# EAGLE design PCB-ENCODER4N (EAGLE 7.5.0)
SKAARHOJ 2012 Rotary Encoder Breakout Board
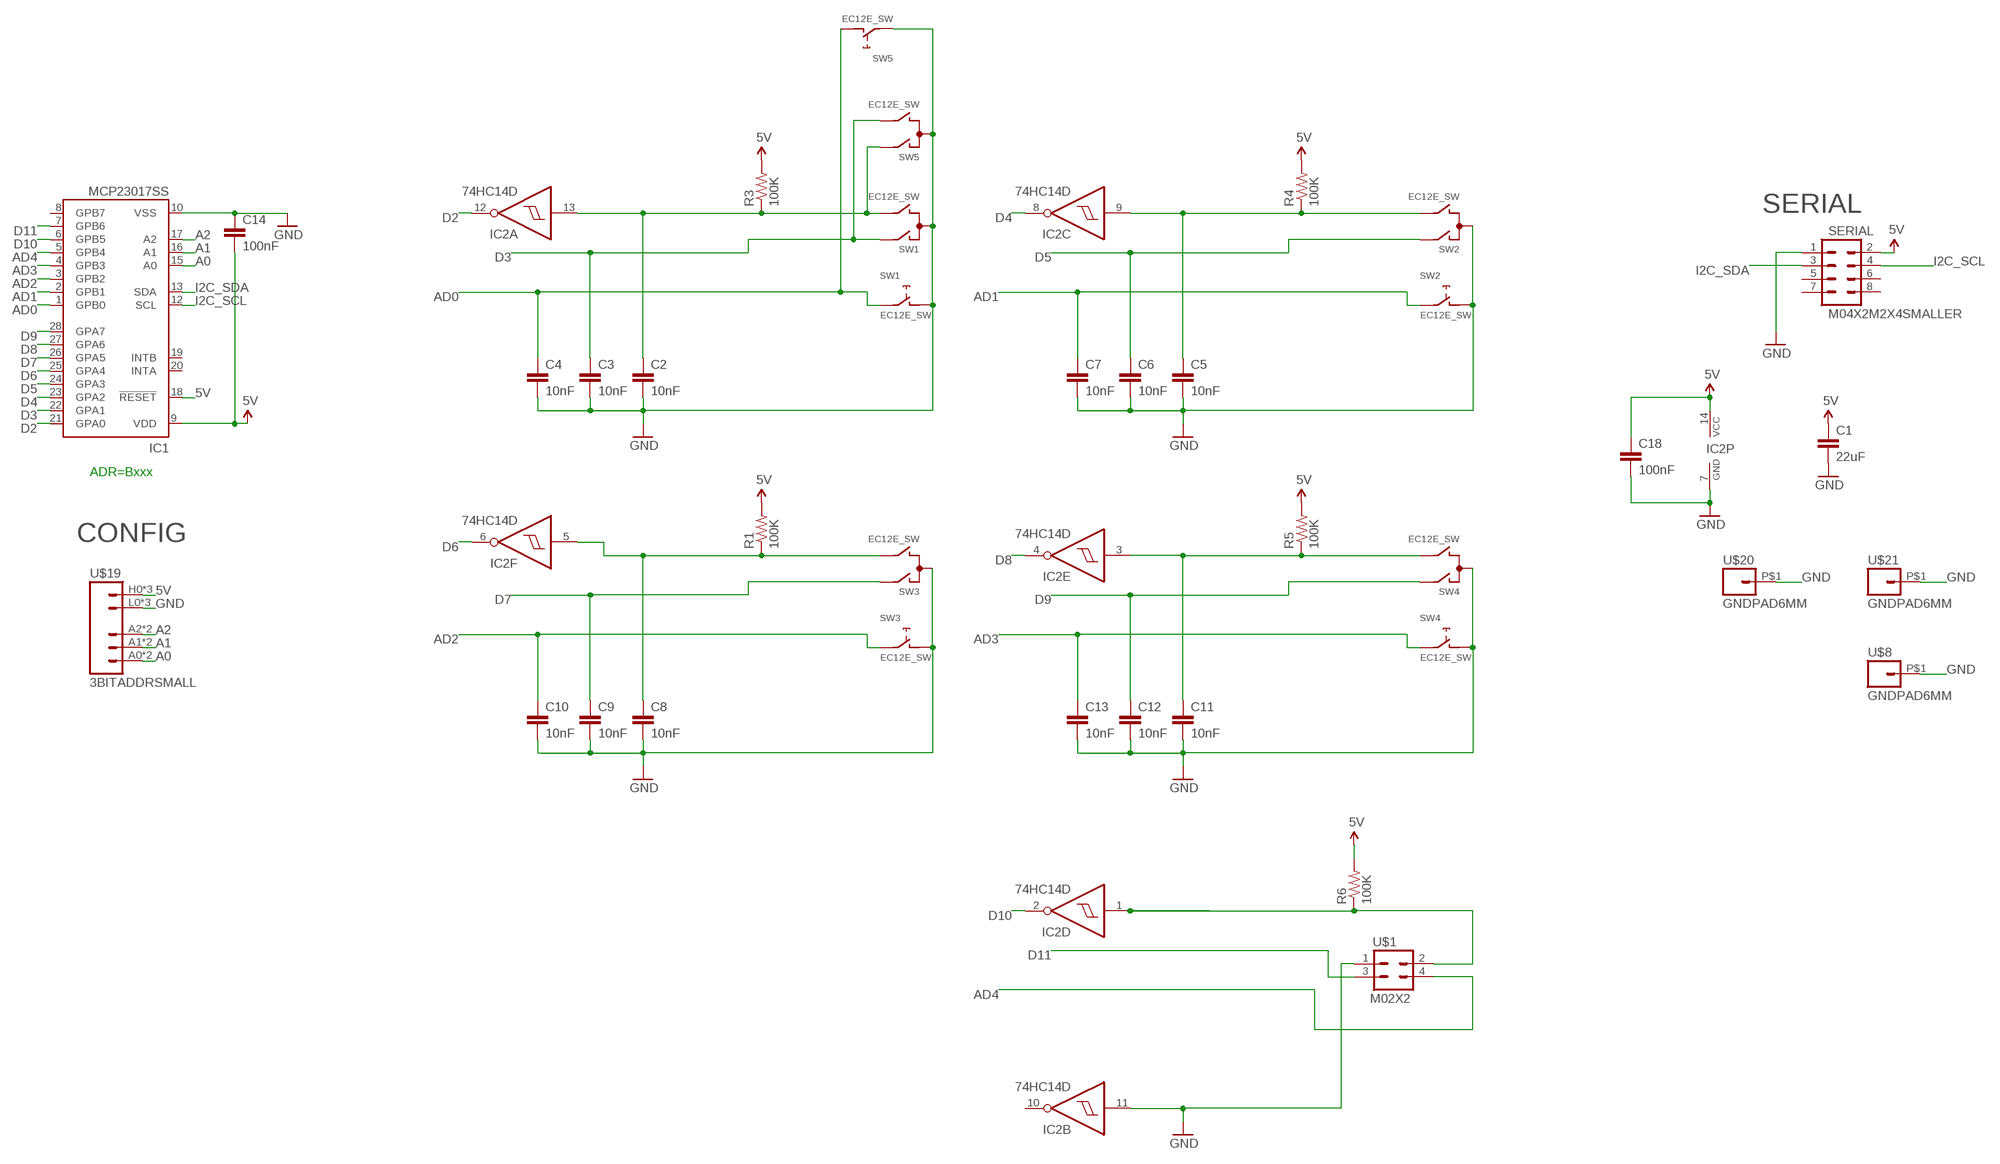
[diagram p0: schematic, sheet 1]

## Parts
C1  22uF  CAP0805  [0805]
C2  10nF  CAP0603-CAP  [0603-CAP]
C3  10nF  CAP0603-CAP  [0603-CAP]
C4  10nF  CAP0603-CAP  [0603-CAP]
C5  10nF  CAP0603-CAP  [0603-CAP]
C6  10nF  CAP0603-CAP  [0603-CAP]
C7  10nF  CAP0603-CAP  [0603-CAP]
C8  10nF  CAP0603-CAP  [0603-CAP]
C9  10nF  CAP0603-CAP  [0603-CAP]
C10  10nF  CAP0603-CAP  [0603-CAP]
C11  10nF  CAP0603-CAP  [0603-CAP]
C12  10nF  CAP0603-CAP  [0603-CAP]
C13  10nF  CAP0603-CAP  [0603-CAP]
C14  100nF  CAP0603-CAP  [0603-CAP]
C18  100nF  CAP0603-CAP  [0603-CAP]
IC1  MCP23017SS  [SSOP28]
IC2  74HC14D  [SO14]
R1  100K  RESISTOR0603-RES  [0603-RES]
R3  100K  RESISTOR0603-RES  [0603-RES]
R4  100K  RESISTOR0603-RES  [0603-RES]
R5  100K  RESISTOR0603-RES  [0603-RES]
R6  100K  RESISTOR0603-RES  [0603-RES]
SERIAL  M04X2M2X4SMALLER  [M2X4SMALLER]
SW1  EC12E_SW  [ALPS_EC12E_SW]
SW2  EC12E_SW  [ALPS_EC12E_SW]
SW3  EC12E_SW  [ALPS_EC12E_SW]
SW4  EC12E_SW  [ALPS_EC12E_SW]
SW5  EC12E_SW  [ALPS_EC12E_SW]
U$1  M02X2  [2X2]
U$8  GNDPAD6MM  [3.2MMPAD6MM]
U$19  3BITADDRSMALL  [3BITADDR_SMALL]
U$20  GNDPAD6MM  [3.2MMPAD6MM]
U$21  GNDPAD6MM  [3.2MMPAD6MM]

## Nets
5V [Power]: C1.1 C14.2 C18.1 IC1.9(VDD) IC1.18(!RESET) IC2.14(P:VCC) R1.2 R3.2 R4.2 R5.2 R6.2 SERIAL.2 U$19.H0(VCC) U$19.H1(VCC) U$19.H2(VCC)
A0: IC1.15(A0) U$19.A0 U$19.AS0(A0)
A1: IC1.16(A1) U$19.A1 U$19.AS1(A1)
A2: IC1.17(A2) U$19.A2 U$19.AS2(A2)
AD0: C4.1 IC1.1(GPB0) SW1.E SW5.D
AD1: C7.1 IC1.2(GPB1) SW2.E
AD2: C10.1 IC1.3(GPB2) SW3.E
AD3: C13.1 IC1.4(GPB3) SW4.E
AD4: IC1.5(GPB4) U$1.4
D2: IC1.21(GPA0) IC2.12(A:O)
D3: C3.1 IC1.22(GPA1) SW1.A SW5.B
D4: IC1.23(GPA2) IC2.8(C:O)
D5: C6.1 IC1.24(GPA3) SW2.A
D6: IC1.25(GPA4) IC2.6(F:O)
D7: C9.1 IC1.26(GPA5) SW3.A
D8: IC1.27(GPA6) IC2.4(E:O)
D9: C12.1 IC1.28(GPA7) SW4.A
D10: IC1.6(GPB5) IC2.2(D:O)
D11: IC1.7(GPB6) U$1.3
GND [Power]: C1.2 C2.2 C3.2 C4.2 C5.2 C6.2 C7.2 C8.2 C9.2 C10.2 C11.2 C12.2 C13.2 C14.1 C18.2 IC1.10(VSS) IC2.7(P:GND) IC2.11(B:I) SERIAL.1 SW1.C SW1.D SW2.C SW2.D SW3.C SW3.D SW4.C SW4.D SW5.C SW5.E U$1.1 U$8.P$1 U$19.L0(GND) U$19.L1(GND) U$19.L2(GND) U$20.P$1 U$21.P$1
I2C_SCL: IC1.12(SCL) SERIAL.4
I2C_SDA: IC1.13(SDA) SERIAL.3
N$2: IC2.1(D:I) R6.1 U$1.2
N$123: C8.1 IC2.5(F:I) R1.1 SW3.B
N$124: C2.1 IC2.13(A:I) R3.1 SW1.B SW5.A
N$125: C5.1 IC2.9(C:I) R4.1 SW2.B
N$126: C11.1 IC2.3(E:I) R5.1 SW4.B
Unconnected: IC1.8(GPB7) IC1.19(INTB) IC1.20(INTA) IC2.10(B:O) SERIAL.5 SERIAL.6 SERIAL.7 SERIAL.8 SW1.GND1(G) SW1.GND2(G) SW2.GND1(G) SW2.GND2(G) SW3.GND1(G) SW3.GND2(G) SW4.GND1(G) SW4.GND2(G) SW5.GND1(G) SW5.GND2(G)

## Notes on the sheet
- SERIAL
- ADR=Bxxx
- CONFIG

## Library data of the parts
C1-C14 C18 = SparkFun:CAP: Capacitor Standard 0603 ceramic capacitor, and 0.1" leaded capacitor.
IC1 = microchip:MCP23017: http://ww1.microchip.com/downloads/en/DeviceDoc/21952a.pdf Source: http://ww1.microchip.com/downloads/en/DeviceDoc/21952a.pdf; MF: MICROCHIP; MPN: MCP23017-E/SS; OC_FARNELL: 1467674; OC_NEWARK: 31K2960
IC2 = 74xx-eu:74*14: Hex schmitt trigger INVERTER
R1 R3-R6 = SparkFun:RESISTOR: Resistor Basic schematic elements and footprints for 0603, 1206, and PTH resistors.
SERIAL = SKAARHOJ:M04X2
SW1-SW5 = SKAARHOJ:EC12E_SW: ALPS rotary Encoder EC12E series with switch; MPN: EC12E2424407; OC_FARNELL: 1520813; OC_NEWARK: 74M1068
U$1 = SKAARHOJ:M02X2
U$8 U$20 U$21 = SKAARHOJ:GNDPAD
U$19 = SKAARHOJ:3BITADDR

## Net classes
0 default: width 0.203 mm, drill 0.406 mm, clearance 0.203 mm
1 Power: width 0.254 mm, drill 0.406 mm, clearance 0.254 mm

## Board
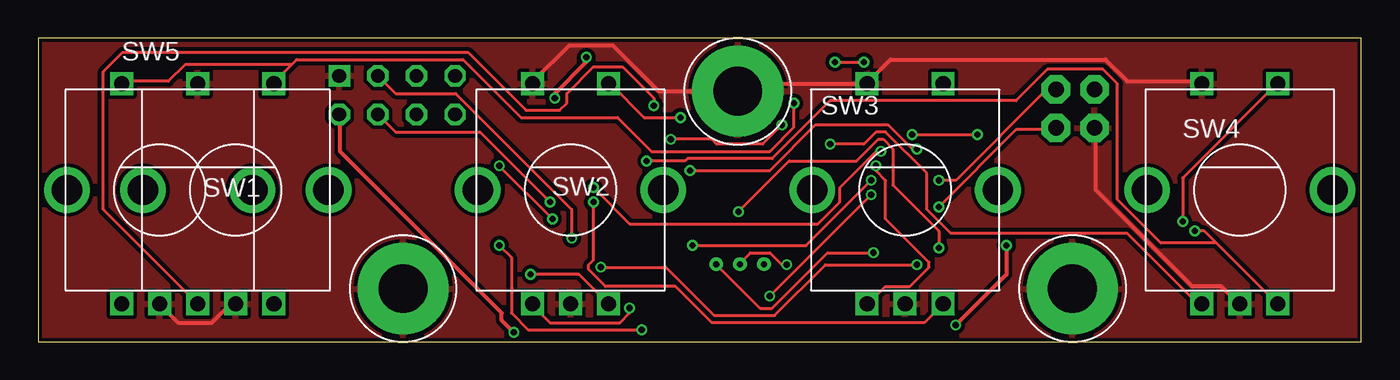
[diagram p1: board, top side]
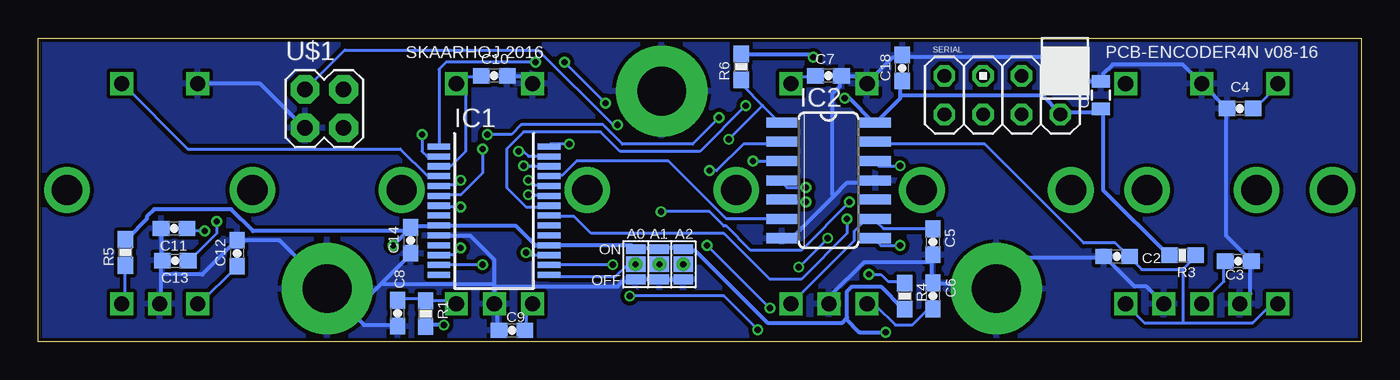
[diagram p2: board, bottom side, seen from below]

Size 87 x 20 mm. Coordinates in mm from the lower left corner, seen from the top.
Outline: 0,0 87,0 87,20 0,20 0,0
Copper layers (1*16): Top 0.035mm / dielectric 1.5mm / Bottom 0.035mm
Design rules "Fusion_eagle_rule_v1.1": minimum track width 6mil, minimum drill 12mil, track to track 6mil, track to pad 6mil, pad to pad 6mil, via to via 6mil, smd to smd 0mil, copper to edge 10mil, drill to drill 10mil, minimum pad ring 10mil, minimum via ring 6mil, stop-mask expansion 2mil, vias tented up to drill 100mil, thermal gap 10mil

### Footprints (pad centres in the part's own frame; a part is rotated, then mirrored left to right if it is on the bottom)
0805 = smd 0.8 x 1.2: 1 -0.9,0; 2 0.9,0
0603-CAP = smd 1.1 x 1: 1 -0.85,0; 2 0.85,0
SSOP28 = smd 0.4 x 1.5: 1 -4.225,-3.625; 2 -3.575,-3.625; 3 -2.925,-3.625; 4 -2.275,-3.625; 5 -1.625,-3.625; 6 -0.975,-3.625; 7 -0.325,-3.625; 8 0.325,-3.625; 9 0.975,-3.625; 10 1.625,-3.625; 11 2.275,-3.625; 12 2.925,-3.625; 13 3.575,-3.625; 14 4.225,-3.625; 15 4.225,3.625; 16 3.575,3.625; 17 2.925,3.625; 18 2.275,3.625; 19 1.625,3.625; 20 0.975,3.625; 21 0.325,3.625; 22 -0.325,3.625; 23 -0.975,3.625; 24 -1.625,3.625; 25 -2.275,3.625; 26 -2.925,3.625; 27 -3.575,3.625; 28 -4.225,3.625
SO14 = smd 0.66 x 2.032: 1 -3.81,-3.073; 2 -2.54,-3.073; 3 -1.27,-3.073; 4 0,-3.073; 5 1.27,-3.073; 6 2.54,-3.073; 7 3.81,-3.073; 8 3.81,3.073; 9 2.54,3.073; 10 1.27,3.073; 11 0,3.073; 12 -1.27,3.073; 13 -2.54,3.073; 14 -3.81,3.073
0603-RES = smd 1.1 x 1: 1 -0.85,0; 2 0.85,0
M2X4SMALLER = drill 0.9 square: 1 -1.27,3.81 | drill 0.9 octagon: 2 1.27,3.81; 3 -1.27,1.27; 4 1.27,1.27; 5 -1.27,-1.27; 6 1.27,-1.27; 7 -1.27,-3.81; 8 1.27,-3.81
ALPS_EC12E_SW = drill 1 square: A -2.5,-7.5; B 2.5,-7.5; C 0,-7.5; D -2.5,7; E 2.5,7 | drill 2: GND1 -6.1,0; GND2 6.1,0
2X2 = drill 1.016 pad 1.88 octagon: 1 -3.81,-1.27; 2 -3.81,1.27; 3 -1.27,-1.27; 4 -1.27,1.27
3.2MMPAD6MM = drill 3.2 pad 6: P$1 0,0
3BITADDR_SMALL = drill 0.4: A0 -1.565,0; A1 0,0; A2 1.565,0 | smd 1.27 x 1: AS0 -1.565,0; AS1 0,0; AS2 1.565,0 | smd 1.27 x 0.635: H0 -1.565,1; H1 0,1; H2 1.565,1; L0 -1.565,-1; L1 0,-1; L2 1.565,-1

### Placement (x,y rotation side)
C1  17.13,16.24 90 bottom
C2  16.09,5.62 180 bottom
C3  8.1,5.32 0 bottom
C4  7.98,15.36 180 bottom
C5  28.18,6.59 270 bottom
C6  28.18,3.03 90 bottom
C7  35.04,17.51 0 bottom
C8  63.36,1.89 270 bottom
C9  55.85,0.76 180 bottom
C10  57.01,17.51 0 bottom
C11  78.06,7.46 180 bottom
C12  73.91,5.84 90 bottom
C13  77.98,5.35 180 bottom
C14  62.51,6.68 90 bottom
C18  30.19,18.03 90 bottom
IC1  57.02,8.64 270 bottom
IC2  35.04,10.64 270 bottom
R1  61.52,1.86 270 bottom
R3  11.76,5.71 180 bottom
R4  30.03,3.02 270 bottom
R5  81.25,5.89 90 bottom
R6  40.78,18.1 90 bottom
SERIAL  23.61,16.24 270 bottom
SW1  13,10 0 top
SW2  35,10 0 top
SW3  57,10 0 top
SW4  79,10 0 top
SW5  8,10 0 top
U$1  65.64,15.35 0 bottom
U$8  46,16.5 0 top
U$19  46.15,5.11 0 bottom
U$20  24,3.5 0 top
U$21  68,3.5 0 top

### Tracks (layer width: path | path; a pad name or v marks a point on that pad's centre or on a via)
5V  (via drill 0.41)
  Top 0.254: v36.04,18.73 36.04,18.41 33.97,16.35 v33.97,16.03 | v60.33,1.11 63.66,4.45 v63.66,6.35 | v31.27,0.64 30.48,1.43 30.48,1.91 19.84,12.54 19.84,14.92 SERIAL.2
  Bottom 0.254: 30.32,16.19 30.32,16.03 31.91,14.45 IC2.14 32.07,14.45 33.66,16.03 v33.97,16.03 | 30.32,16.19 30.32,17.14 C18.1 | v36.04,18.73 36.2,18.89 40.64,18.89 R6.2 | 16.99,15.08 16.99,15.24 C1.1 16.99,15.08 | 16.99,15.08 16.99,10 12.7,5.71 R3.2 | 16.99,15.08 19.68,15.08 SERIAL.2 19.84,15.08 20.95,16.19 30.32,16.19 | v60.33,1.11 61.44,1.11 R1.2 | v63.66,6.35 62.55,7.46 C14.2 | R5.2 81.12,6.83 79.85,8.1 79.85,8.26 79.38,8.73 74.3,8.73 72.87,7.3 62.87,7.3 C14.2 | C14.2 62.39,7.62 60.8,7.62 IC1.9 60.64,7.62 55.56,7.62 54.29,6.35 53.5,6.35 IC1.18 53.34,6.35 47.94,6.35 47.78,6.19 U$19.H0 47.62,6.19 46.2,6.19 U$19.H1 46.04,6.19 44.61,6.19 U$19.H2 44.45,6.03 43.81,6.03 39.05,1.27 34.13,1.27 33.89,1.51 | 33.89,1.51 33.81,1.59 33.81,3.33 33.5,3.65 31.59,3.65 30.16,2.22 R4.2 | v31.27,0.64 33.02,0.64 33.89,1.51
A0
  Bottom 0.203: IC1.15 53.34,4.29 49.05,4.29 48.26,5.08 47.78,5.08 U$19.AS0
A1  (via drill 0.41)
  Top 0.203: v49.21,5.08 48.9,5.08 48.1,5.87 46.83,5.87 46.2,5.24 U$19.AS1
  Bottom 0.203: 46.2,5.08 U$19.AS1 | v49.21,5.08 53.34,5.08 IC1.16
A2  (via drill 0.41)
  Top 0.203: v54.93,5.87 51.91,5.87 48.26,2.22 47.47,2.22 44.61,5.08 U$19.AS2
  Bottom 0.203: 44.61,5.08 U$19.AS2 | v54.93,5.87 54.77,5.71 53.5,5.71 IC1.17
AD0  (via drill 0.41)
  Top 0.203: v52.39,18.41 v54.29,18.41 | v49.69,15.72 49.69,14.13 48.1,12.54 40.32,12.54 38.1,14.76 31.75,14.76 27.94,18.57 16.99,18.57 16.67,18.26 | 16.67,18.26 15.56,17.14 SW1.E | 16.67,18.26 9.68,18.26 8.57,17.14 5.56,17.14 SW5.D
  Bottom 0.203: C4.1 6.99,15.4 5.4,16.99 SW5.D | v54.29,18.41 60.17,18.41 60.64,17.94 60.64,13.02 IC1.1 | v49.69,15.72 v52.39,18.41
AD1  (via drill 0.41)
  Top 0.203: v57.47,13.65 v61.75,13.65 | v42.23,14.76 39.85,14.76 37.62,16.99 SW2.E
  Bottom 0.203: C7.1 36.04,17.46 37.15,17.46 37.47,17.14 SW2.E | v61.75,13.65 61.75,12.54 61.44,12.22 60.8,12.22 IC1.2 | v57.47,13.65 55.88,13.65 55.24,14.29 49.85,14.29 48.58,13.02 43.97,13.02 v42.23,14.76
AD2
  Bottom 0.203: 58.9,17.46 59.05,17.46 59.37,17.14 SW3.E 58.9,17.46 | 58.9,17.46 57.94,17.46 C10.1 | 58.9,17.46 58.9,12.54 59.85,11.59 60.64,11.59 IC1.3
AD3  (via drill 0.41)
  Top 0.203: v75.25,7.94 75.25,10.79 81.44,16.99 SW4.E
  Bottom 0.203: v75.25,7.94 75.25,7.14 76.99,5.4 C13.1 | IC1.4 60.8,10.95 61.44,10.95 63.18,12.7 77.15,12.7 81.44,16.99 SW4.E
AD4  (via drill 0.41)
  Top 0.203: v59.21,10.64 60.33,10.64 66.2,16.51 66.83,16.51 U$1.4
  Bottom 0.203: v59.21,10.64 59.53,10.32 60.64,10.32 IC1.5
D2  (via drill 0.41)
  Top 0.203: v30.32,11.59 v33.81,8.1
  Bottom 0.203: v33.81,8.1 33.81,7.14 36.83,4.13 38.89,4.13 41.91,7.14 50.64,7.14 51.75,8.26 53.34,8.26 IC1.21 | v30.32,11.59 31.75,11.59 31.91,11.75 IC2.12
D3  (via drill 0.41)
  Top 0.203: v40.48,15.56 40.48,16.03 38.42,18.1 36.51,18.1 34.77,16.35 34.77,15.72 34.29,15.24 32.07,15.24 28.26,19.05 5.56,19.05 4.29,17.78 4.29,8.73 10.48,2.54 SW5.B
  Bottom 0.203: C3.1 9.05,5.24 9.05,3.97 10.48,2.54 SW5.B | v40.48,15.56 43.5,12.54 48.74,12.54 50.01,13.81 55.09,13.81 56.2,12.7 56.2,10.16 54.93,8.89 53.5,8.89 IC1.22
D4  (via drill 0.41)
  Top 0.203: v48.1,3.02 v54.77,9.68 | v39.69,0.79 32.23,0.79 31.11,1.91 31.11,5.56 v30.32,6.35
  Bottom 0.203: v54.77,9.68 53.5,9.68 IC1.23 | v48.1,3.02 41.91,3.02 v39.69,0.79 | v30.32,6.35 31.59,6.35 31.91,6.67 IC2.8
D5  (via drill 0.41)
  Top 0.203: v54.77,10.64 50.48,6.35 v43.02,6.35 | v38.89,2.22 38.89,1.91 38.26,1.27 33.66,1.27 32.54,2.38 SW2.A
  Bottom 0.203: C6.1 28.26,2.06 28.57,2.06 29.53,1.11 30.64,1.11 31.91,2.38 32.38,2.38 SW2.A | v54.77,10.64 54.45,10.32 53.5,10.32 IC1.24 | v38.89,2.22 v43.02,6.35
D6
  Bottom 0.203: IC1.25 53.34,10.95 52.55,10.95 51.59,11.91 45.56,11.91 41.75,8.1 38.26,8.1 IC2.6
D7  (via drill 0.41)
  Top 0.203: v55.09,11.59 55.09,11.27 55.72,10.64 55.72,8.1 58.58,5.24 58.58,4.92 57.31,3.65 55.72,3.65 54.61,2.54 SW3.A
  Bottom 0.203: C9.1 54.93,0.79 54.93,2.06 54.61,2.38 SW3.A | v55.09,11.59 53.5,11.59 IC1.26
D8  (via drill 0.41)
  Top 0.203: v55.4,12.54 55.09,12.54 52.7,10.16 52.7,9.21 51.28,7.78 38.89,7.78 v36.51,10.16
  Bottom 0.203: v55.4,12.54 55.09,12.54 54.77,12.22 53.5,12.22 IC1.27 | v36.51,10.16 37.78,10.16 38.1,10.48 IC2.4
D9  (via drill 0.41)
  Top 0.203: v52.07,13.02 54.29,13.02 55.09,13.81 55.72,13.81 58.42,11.11 58.42,8.73 60.01,7.14 71.6,7.14 76.36,2.38 SW4.A
  Bottom 0.203: C12.1 73.98,4.92 76.36,2.54 SW4.A | v52.07,13.02 53.34,13.02 IC1.28
D10  (via drill 0.41)
  Top 0.203: v57.78,12.7 57.47,12.7 55.88,14.29 51.12,14.29 48.1,11.27 v42.86,11.27
  Bottom 0.203: v57.78,12.7 57.78,11.11 59.21,9.68 60.64,9.68 IC1.6 | v42.86,11.27 42.39,11.27 40.64,13.02 38.26,13.02 IC2.2
D11  (via drill 0.41)
  Top 0.203: v59.21,8.89 64.29,13.97 66.83,13.97 U$1.3
  Bottom 0.203: v59.21,8.89 60.64,8.89 IC1.7
GND
  Top 0.254: U$1.1 69.53,13.97 69.53,10 75.88,3.65 77.79,3.65 78.9,2.54 SW4.C | 10.48,16.99 SW5.E | SW2.D 32.54,17.14 34.92,19.53 37.78,19.53 40.8,16.51 45.88,16.51 U$8.P$1 46.04,16.51 46.51,16.99 54.45,16.99 SW3.D 54.61,17.14 56.04,18.57 70.17,18.57 71.6,17.14 76.36,17.14 SW4.D | SW1.C 12.86,2.38 12.54,2.38 11.43,1.27 9.21,1.27 8.1,2.38 SW5.C
  Bottom 0.254: U$19.L2 44.61,4.13 46.04,4.13 U$19.L1 46.2,4.13 47.62,4.13 U$19.L0 47.78,3.97 48.58,3.97 48.9,3.65 56.99,3.65 | C9.2 56.83,0.79 56.83,2.22 56.99,2.38 SW3.C 56.99,2.54 56.99,3.65 | 56.99,3.65 56.99,3.81 | 56.99,3.81 56.99,5.4 58.58,6.99 60.64,6.99 IC1.10 | SW4.D 76.36,16.99 72.39,16.99 69.53,14.13 U$1.1 | C11.2 78.9,7.3 78.9,5.4 C13.2 78.9,5.24 78.9,4.45 | 78.9,4.45 78.9,2.54 SW4.C | 66.36,1.91 67.94,3.49 U$21.P$1 | 66.36,1.91 65.56,1.11 63.5,1.11 C8.2 | 66.36,1.91 64.37,3.89 | 64.37,3.89 62.55,5.71 C14.1 | 66.36,1.91 U$21.P$1 | U$21.P$1 68.1,3.65 71.12,6.67 73.82,6.67 C12.2 73.98,6.67 76.2,4.45 78.9,4.45 | 56.99,3.81 64.29,3.81 64.37,3.89 | SW1.C 13.02,2.54 14.13,3.65 14.92,3.65 16.83,5.56 C2.2 16.99,5.56 22.07,5.56 23.97,3.65 U$20.P$1 24.13,3.65 24.29,3.81 28.1,3.81 C6.2 28.26,3.97 28.26,5.24 | 28.26,5.24 28.26,5.71 C5.2 28.26,5.24 | 28.26,5.24 32.7,5.24 34.92,3.02 34.92,2.54 SW2.C | C10.2 56.04,17.46 54.93,17.46 54.61,17.14 SW3.D | 34.69,9.6 37.47,6.83 IC2.7 | 34.69,9.6 33.81,10.48 32.07,10.48 IC2.11 | 34.69,9.6 34.77,9.68 34.77,16.35 34.29,16.83 34.29,17.46 C7.2 34.13,17.46 32.86,17.46 32.54,17.14 SW2.D 32.38,17.14 30.8,18.73 30.32,18.73 C18.2 30.16,18.73 20.95,18.73 19.84,17.62 SERIAL.1 19.68,17.46 19.37,17.14 17.14,17.14 C1.2 16.99,17.14 16.99,17.62 16.35,18.26 11.75,18.26 10.64,17.14 SW5.E 10.48,16.99 8.89,15.4 C4.2 8.89,15.24 8.89,6.99 7.3,5.4 C3.2 7.3,5.24 7.3,3.17 7.94,2.54 SW5.C
  pour Top: 0,0 87,0 87,20 0,20
  pour Bottom: 0,0 87,0 87,20 0,20
I2C_SCL  (via drill 0.41)
  Top 0.203: v59.21,6.19 59.21,7.3 56.2,10.32 56.2,12.7 55.56,13.34 55.24,13.34 53.82,11.91 49.37,11.91 v46.04,8.57 | v33.66,9.21 29.05,13.81 23.5,13.81 22.38,14.92 SERIAL.4
  Bottom 0.203: v59.21,6.19 59.69,5.71 IC1.12 | v46.04,8.57 42.86,8.57 41.91,7.62 41.75,7.62 40.16,6.03 36.83,6.03 v33.66,9.21
I2C_SDA  (via drill 0.41)
  Top 0.203: v57.78,5.08 51.75,5.08 48.42,1.75 44.45,1.75 41.27,4.92 v36.99,4.92 | v35.08,6.83 35.08,8.73 27.46,16.35 23.5,16.35 22.38,17.46 SERIAL.3
  Bottom 0.203: v57.78,5.08 60.64,5.08 IC1.13 | v35.08,6.83 v36.99,4.92
N$2  (via drill 0.41)
  Top 0.203: v41.59,13.34 44.29,13.34 44.61,13.02 47.62,13.02 v48.9,14.29
  Bottom 0.203: 39.37,15.56 38.26,14.45 IC2.1 | 39.37,15.56 40.64,16.83 40.64,17.14 R6.1 | v41.59,13.34 39.37,15.56 | v48.9,14.29 49.21,14.29 54.13,19.21 66.83,19.21 69.37,16.67 U$1.2
N$123  (via drill 0.41)
  Top 0.203: v36.51,9.21 36.51,5.4 36.2,5.08 36.2,4.76 37.31,3.65 41.91,3.65 44.29,1.27 58.26,1.27 59.37,2.38 SW3.B
  Bottom 0.203: C8.1 63.34,2.86 61.59,2.86 R1.1 61.44,2.7 59.69,2.7 59.53,2.54 SW3.B | v36.51,9.21 38.1,9.21 IC2.5
N$124
  Bottom 0.203: 11.75,1.27 14.29,1.27 15.4,2.38 SW1.B | 11.75,1.27 7.14,1.27 6.03,2.38 5.56,2.38 SW5.A | 11.75,4.76 10.95,5.56 R3.1 | 11.75,4.76 14.45,4.76 15.24,5.56 C2.1 15.4,5.71 16.19,6.51 18.26,6.51 24.77,13.02 31.91,13.02 IC2.13 | 11.75,4.76 11.75,1.27
N$125  (via drill 0.41)
  Top 0.203: v32.38,4.45 35.56,4.45 37.47,2.54 SW2.B
  Bottom 0.203: C5.1 28.26,7.46 31.43,7.46 31.91,7.94 IC2.9 32.07,7.94 32.7,7.94 33.34,7.3 33.34,6.67 37.47,2.54 SW2.B | v32.38,4.45 31.59,4.45 31.11,3.97 30.16,3.97 R4.1
N$126  (via drill 0.41)
  Top 0.203: v76.04,7.3 76.68,7.3 77.47,6.51 | 77.47,6.51 81.44,2.54 SW4.B | v40.01,11.91 42.55,11.91 42.7,12.06 48.26,12.06 52.07,15.88 64.29,15.88 66.36,17.94 70.01,17.94 70.96,16.99 70.96,9.37 73.82,6.51 77.47,6.51
  Bottom 0.203: R5.1 81.28,4.92 81.28,2.7 81.44,2.54 SW4.B | v76.04,7.3 77.15,7.3 C11.1 | v40.01,11.91 38.26,11.91 IC2.3

### Text on the board
_bsilk: PCB-ENCODER4N v08-16 | SKAARHOJ 2016